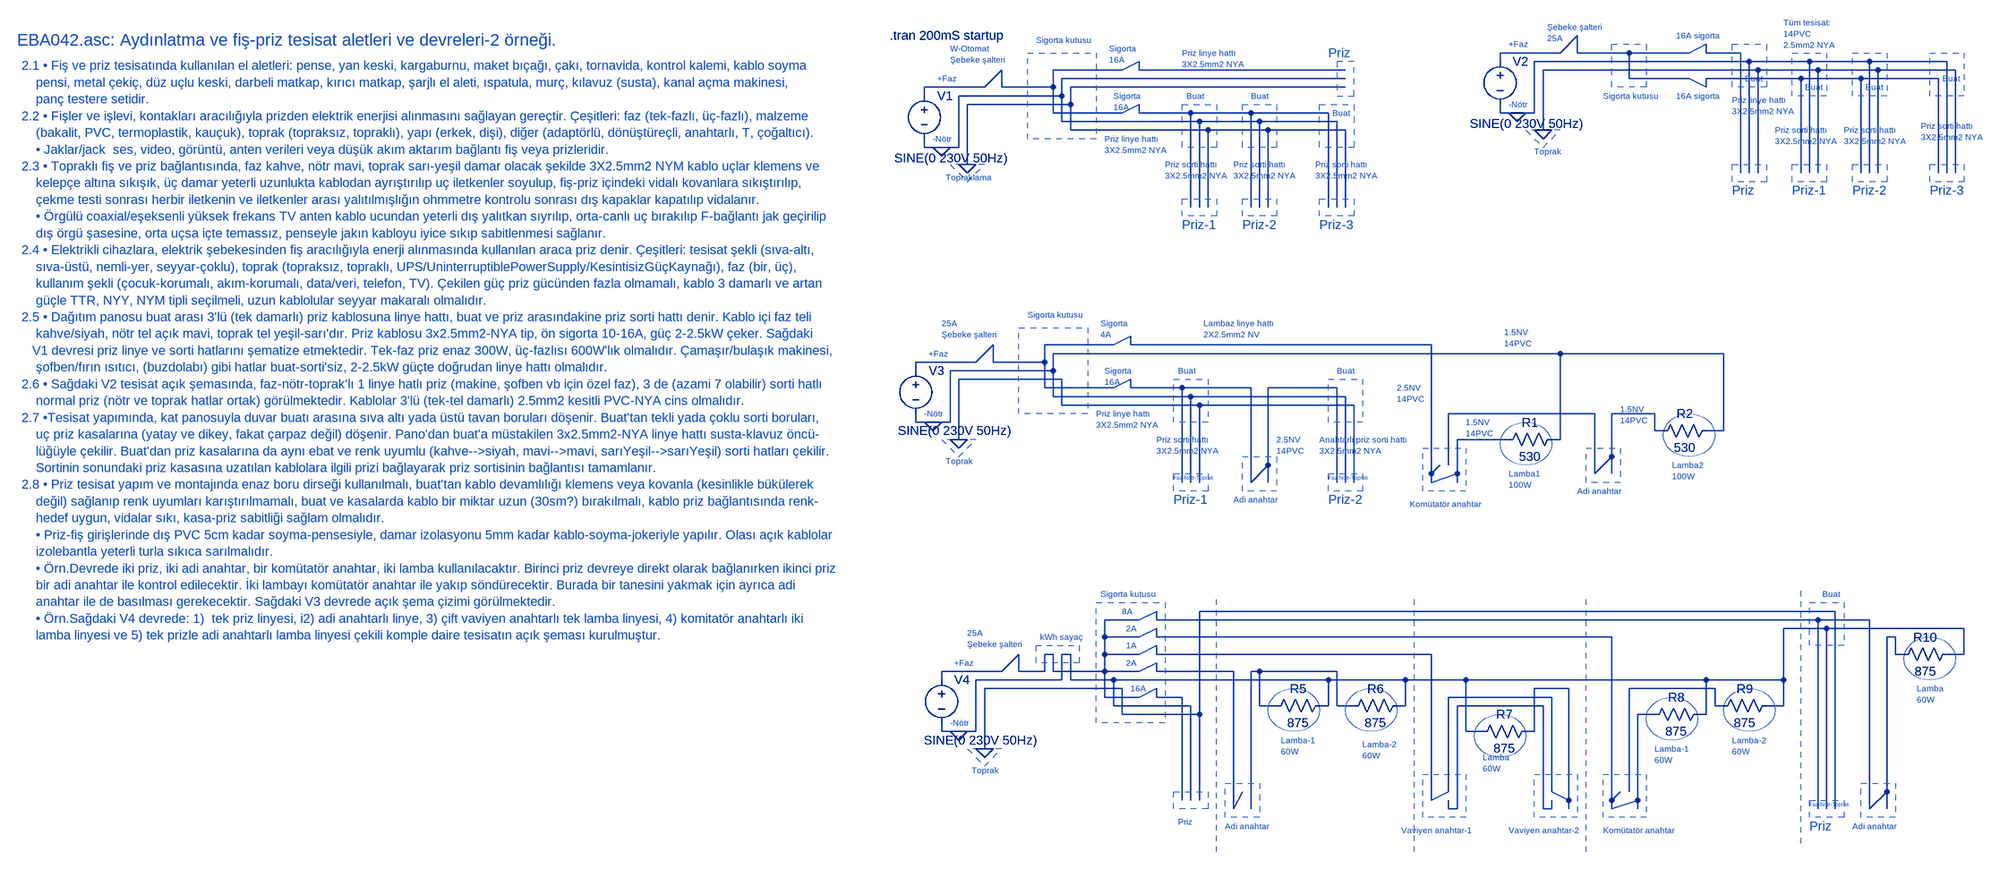
[diagram p0: schematic EBA042.asc]
EBA042.asc, the LTspice schematic file:
Version 4
SHEET 1 4076 2612
WIRE 3008 64 3040 32
WIRE 3008 64 2896 64
WIRE 3040 64 3040 32
WIRE 3136 64 3040 64
WIRE 3248 64 3280 48
WIRE 3248 64 3136 64
WIRE 3280 64 3280 48
WIRE 3344 64 3280 64
WIRE 2896 80 2896 64
WIRE 3360 80 2960 80
WIRE 3472 80 3360 80
WIRE 3584 80 3472 80
WIRE 3728 80 3584 80
WIRE 2192 96 2224 80
WIRE 2192 96 2064 96
WIRE 2224 96 2224 80
WIRE 2608 96 2224 96
WIRE 3376 96 2976 96
WIRE 3488 96 3376 96
WIRE 3600 96 3488 96
WIRE 3744 96 3600 96
WIRE 2608 112 2080 112
WIRE 3136 112 3136 64
WIRE 3248 112 3136 112
WIRE 3456 112 3280 112
WIRE 3568 112 3456 112
WIRE 3712 112 3568 112
WIRE 1936 128 1968 96
WIRE 1936 128 1824 128
WIRE 1968 128 1968 96
WIRE 2064 128 2064 96
WIRE 2064 128 1968 128
WIRE 2608 128 2096 128
WIRE 3280 128 3248 112
WIRE 3280 128 3280 112
WIRE 1824 144 1824 128
WIRE 2080 144 2080 112
WIRE 2080 144 1888 144
WIRE 2096 160 2096 128
WIRE 2096 160 1904 160
WIRE 2064 176 2064 128
WIRE 2192 176 2224 160
WIRE 2192 176 2064 176
WIRE 2224 176 2224 160
WIRE 2320 176 2224 176
WIRE 2432 176 2320 176
WIRE 2576 176 2432 176
WIRE 2896 176 2896 160
WIRE 2928 176 2896 176
WIRE 2960 176 2960 80
WIRE 2960 176 2928 176
WIRE 2080 192 2080 144
WIRE 2336 192 2080 192
WIRE 2448 192 2336 192
WIRE 2592 192 2448 192
WIRE 2096 208 2096 160
WIRE 2352 208 2096 208
WIRE 2464 208 2352 208
WIRE 2608 208 2464 208
WIRE 2976 208 2976 96
WIRE 1824 240 1824 224
WIRE 1856 240 1824 240
WIRE 1888 240 1888 144
WIRE 1888 240 1856 240
WIRE 1904 272 1904 160
WIRE 3344 288 3344 64
WIRE 3360 288 3360 80
WIRE 3376 288 3376 96
WIRE 3456 288 3456 112
WIRE 3472 288 3472 80
WIRE 3488 288 3488 96
WIRE 3568 288 3568 112
WIRE 3584 288 3584 80
WIRE 3600 288 3600 96
WIRE 3712 288 3712 112
WIRE 3728 288 3728 80
WIRE 3744 288 3744 96
WIRE 2320 352 2320 176
WIRE 2336 352 2336 192
WIRE 2352 352 2352 208
WIRE 2432 352 2432 176
WIRE 2448 352 2448 192
WIRE 2464 352 2464 208
WIRE 2576 352 2576 176
WIRE 2592 352 2592 192
WIRE 2608 352 2608 208
WIRE 2176 608 2208 592
WIRE 2176 608 2048 608
WIRE 2208 608 2208 592
WIRE 2768 608 2208 608
WIRE 3008 624 2064 624
WIRE 3312 624 3008 624
WIRE 1920 640 1952 608
WIRE 1920 640 1808 640
WIRE 1952 640 1952 608
WIRE 2048 640 2048 608
WIRE 2048 640 1952 640
WIRE 1808 656 1808 640
WIRE 2064 656 2064 624
WIRE 2064 656 1872 656
WIRE 2080 672 1888 672
WIRE 2048 688 2048 640
WIRE 2176 688 2208 672
WIRE 2176 688 2048 688
WIRE 2208 688 2208 672
WIRE 2304 688 2208 688
WIRE 2432 688 2304 688
WIRE 2592 688 2464 688
WIRE 2064 704 2064 656
WIRE 2320 704 2064 704
WIRE 2608 704 2320 704
WIRE 2080 720 2080 672
WIRE 2336 720 2080 720
WIRE 2624 720 2336 720
WIRE 3072 736 2800 736
WIRE 3184 736 3104 736
WIRE 1808 752 1808 736
WIRE 1840 752 1808 752
WIRE 1872 752 1872 656
WIRE 1872 752 1840 752
WIRE 3184 768 3184 736
WIRE 3200 768 3184 768
WIRE 3312 768 3312 624
WIRE 3312 768 3280 768
WIRE 1888 784 1888 672
WIRE 2912 784 2816 784
WIRE 3008 784 3008 624
WIRE 3008 784 2992 784
WIRE 3104 816 3104 736
WIRE 2464 832 2464 688
WIRE 2800 832 2800 736
WIRE 2768 848 2768 608
WIRE 2768 848 2784 832
WIRE 2816 848 2816 784
WIRE 3072 848 3072 736
WIRE 3072 848 3104 816
WIRE 3104 848 3104 816
WIRE 2304 864 2304 688
WIRE 2320 864 2320 704
WIRE 2336 864 2336 720
WIRE 2432 864 2432 688
WIRE 2432 864 2464 832
WIRE 2464 864 2464 832
WIRE 2592 864 2592 688
WIRE 2608 864 2608 704
WIRE 2624 864 2624 720
WIRE 2768 864 2768 848
WIRE 2768 864 2816 848
WIRE 2816 864 2816 848
WIRE 3520 1104 2336 1104
WIRE 2224 1120 2256 1104
WIRE 2224 1120 2160 1120
WIRE 2256 1120 2256 1104
WIRE 3488 1120 2256 1120
WIRE 3584 1120 3488 1120
WIRE 3504 1136 3424 1136
WIRE 3760 1136 3504 1136
WIRE 2160 1152 2160 1120
WIRE 2224 1152 2256 1136
WIRE 2224 1152 2160 1152
WIRE 2256 1152 2256 1136
WIRE 3104 1152 2256 1152
WIRE 3632 1152 3616 1152
WIRE 2064 1184 2048 1184
WIRE 2096 1184 2080 1184
WIRE 2160 1184 2160 1152
WIRE 2224 1184 2256 1168
WIRE 2224 1184 2160 1184
WIRE 2256 1184 2256 1168
WIRE 2768 1184 2256 1184
WIRE 3632 1184 3632 1152
WIRE 3648 1184 3632 1184
WIRE 3760 1184 3760 1136
WIRE 3760 1184 3728 1184
WIRE 1968 1216 2000 1184
WIRE 1968 1216 1856 1216
WIRE 2000 1216 2000 1184
WIRE 2048 1216 2048 1184
WIRE 2048 1216 2000 1216
WIRE 2064 1216 2064 1184
WIRE 2160 1216 2160 1184
WIRE 2160 1216 2064 1216
WIRE 2224 1216 2256 1200
WIRE 2224 1216 2160 1216
WIRE 2256 1216 2256 1200
WIRE 2400 1216 2256 1216
WIRE 2448 1216 2432 1216
WIRE 2592 1216 2448 1216
WIRE 1856 1232 1856 1216
WIRE 2080 1232 2080 1184
WIRE 2080 1232 1920 1232
WIRE 2096 1232 2096 1184
WIRE 2176 1232 2096 1232
WIRE 2576 1232 2176 1232
WIRE 2720 1232 2576 1232
WIRE 2832 1232 2720 1232
WIRE 3280 1232 2832 1232
WIRE 3424 1232 3424 1136
WIRE 3424 1232 3280 1232
WIRE 2192 1248 1936 1248
WIRE 3024 1248 2960 1248
WIRE 3296 1248 3136 1248
WIRE 2160 1264 2160 1216
WIRE 2224 1264 2256 1248
WIRE 2224 1264 2160 1264
WIRE 2256 1264 2256 1248
WIRE 2304 1264 2256 1264
WIRE 2992 1264 2800 1264
WIRE 2176 1280 2176 1232
WIRE 2320 1280 2176 1280
WIRE 2448 1280 2448 1216
WIRE 2480 1280 2448 1280
WIRE 2576 1280 2576 1232
WIRE 2576 1280 2560 1280
WIRE 2592 1280 2592 1216
WIRE 2624 1280 2592 1280
WIRE 2720 1280 2720 1232
WIRE 2720 1280 2704 1280
WIRE 2976 1280 2816 1280
WIRE 3296 1280 3296 1248
WIRE 3312 1280 3296 1280
WIRE 3424 1280 3424 1232
WIRE 3424 1280 3392 1280
WIRE 2192 1296 2192 1248
WIRE 2336 1296 2336 1104
WIRE 2336 1296 2192 1296
WIRE 3184 1296 3152 1296
WIRE 3280 1296 3280 1232
WIRE 3280 1296 3264 1296
WIRE 1856 1328 1856 1312
WIRE 1888 1328 1856 1328
WIRE 1920 1328 1920 1232
WIRE 1920 1328 1888 1328
WIRE 2832 1328 2832 1232
WIRE 2864 1328 2832 1328
WIRE 2960 1328 2960 1248
WIRE 2960 1328 2944 1328
WIRE 1936 1360 1936 1248
WIRE 2800 1440 2800 1264
WIRE 2992 1440 2992 1264
WIRE 3136 1440 3136 1248
WIRE 3616 1440 3616 1152
WIRE 2304 1456 2304 1264
WIRE 2320 1456 2320 1280
WIRE 2336 1456 2336 1296
WIRE 2768 1456 2768 1184
WIRE 2768 1456 2800 1440
WIRE 3024 1456 3024 1248
WIRE 3024 1456 2992 1440
WIRE 3104 1456 3104 1152
WIRE 3104 1456 3120 1440
WIRE 3152 1456 3152 1296
WIRE 2400 1472 2400 1216
WIRE 2400 1472 2416 1440
WIRE 2432 1472 2432 1216
WIRE 2800 1472 2800 1456
WIRE 2816 1472 2816 1280
WIRE 2816 1472 2800 1472
WIRE 2976 1472 2976 1280
WIRE 2992 1472 2992 1456
WIRE 2992 1472 2976 1472
WIRE 3024 1472 3024 1456
WIRE 3104 1472 3104 1456
WIRE 3104 1472 3152 1456
WIRE 3152 1472 3152 1456
WIRE 3488 1472 3488 1120
WIRE 3504 1472 3504 1136
WIRE 3520 1472 3520 1104
WIRE 3584 1472 3584 1120
WIRE 3584 1472 3616 1440
WIRE 3616 1472 3616 1440
FLAG 1856 240 0
FLAG 1904 272 0
FLAG 2928 176 0
FLAG 2976 208 0
FLAG 1840 752 0
FLAG 1888 784 0
FLAG 1888 1328 0
FLAG 1936 1360 0
SYMBOL voltage 1824 128 R0
WINDOW 3 -56 132 Left 2
WINDOW 123 0 0 Left 0
WINDOW 39 0 0 Left 0
SYMATTR Value SINE(0 230V 50Hz)
SYMATTR InstName V1
SYMBOL voltage 2896 64 R0
WINDOW 3 -56 132 Left 2
WINDOW 123 0 0 Left 0
WINDOW 39 0 0 Left 0
SYMATTR Value SINE(0 230V 50Hz)
SYMATTR InstName V2
SYMBOL voltage 1808 640 R0
WINDOW 3 -33 128 Left 2
WINDOW 123 0 0 Left 0
WINDOW 39 0 0 Left 0
SYMATTR Value SINE(0 230V 50Hz)
SYMATTR InstName V3
SYMBOL res 3008 768 R90
WINDOW 0 0 56 VBottom 2
WINDOW 3 32 56 VTop 2
SYMATTR InstName R1
SYMATTR Value 530
SYMBOL res 3296 752 R90
WINDOW 0 0 56 VBottom 2
WINDOW 3 32 56 VTop 2
SYMATTR InstName R2
SYMATTR Value 530
SYMBOL voltage 1856 1216 R0
WINDOW 3 -33 128 Left 2
WINDOW 123 0 0 Left 0
WINDOW 39 0 0 Left 0
SYMATTR Value SINE(0 230V 50Hz)
SYMATTR InstName V4
SYMBOL res 2576 1264 R90
WINDOW 0 0 56 VBottom 2
WINDOW 3 32 56 VTop 2
SYMATTR InstName R5
SYMATTR Value 875
SYMBOL res 2720 1264 R90
WINDOW 0 0 56 VBottom 2
WINDOW 3 32 56 VTop 2
SYMATTR InstName R6
SYMATTR Value 875
SYMBOL res 2960 1312 R90
WINDOW 0 0 56 VBottom 2
WINDOW 3 32 56 VTop 2
SYMATTR InstName R7
SYMATTR Value 875
SYMBOL res 3280 1280 R90
WINDOW 0 0 56 VBottom 2
WINDOW 3 32 56 VTop 2
SYMATTR InstName R8
SYMATTR Value 875
SYMBOL res 3408 1264 R90
WINDOW 0 0 56 VBottom 2
WINDOW 3 32 56 VTop 2
SYMATTR InstName R9
SYMATTR Value 875
SYMBOL res 3744 1168 R90
WINDOW 0 0 56 VBottom 2
WINDOW 3 32 56 VTop 2
SYMATTR InstName R10
SYMATTR Value 875
TEXT -152 40 Left 3 ;EBA042.asc: Aydınlatma ve fiş-priz tesisat aletleri ve devreleri-2 örneği.
TEXT -144 88 Left 2 ;2.1 • Fiş ve priz tesisatında kullanılan el aletleri: pense, yan keski, kargaburnu, maket bıçağı, çakı, tornavida, kontrol kalemi, kablo soyma\n    pensi, metal çekiç, düz uçlu keski, darbeli matkap, kırıcı matkap, şarjlı el aleti, ıspatula, murç, kılavuz (susta), kanal açma makinesi, \n    panç testere setidir.\n2.2 • Fişler ve işlevi, kontakları aracılığıyla prizden elektrik enerjisi alınmasını sağlayan gereçtir. Çeşitleri: faz (tek-fazlı, üç-fazlı), malzeme\n    (bakalit, PVC, termoplastik, kauçuk), toprak (topraksız, topraklı), yapı (erkek, dişi), diğer (adaptörlü, dönüştüreçli, anahtarlı, T, çoğaltıcı).\n    • Jaklar/jack  ses, video, görüntü, anten verileri veya düşük akım aktarım bağlantı fiş veya prizleridir.\n2.3 • Topraklı fiş ve priz bağlantısında, faz kahve, nötr mavi, toprak sarı-yeşil damar olacak şekilde 3X2.5mm2 NYM kablo uçlar klemens ve\n    kelepçe altına sıkışık, üç damar yeterli uzunlukta kablodan ayrıştırılıp uç iletkenler soyulup, fiş-priz içindeki vidalı kovanlara sıkıştırılıp, \n    çekme testi sonrası herbir iletkenin ve iletkenler arası yalıtılmışlığın ohmmetre kontrolu sonrası dış kapaklar kapatılıp vidalanır.\n    • Örgülü coaxial/eşeksenli yüksek frekans TV anten kablo ucundan yeterli dış yalıtkan sıyrılıp, orta-canlı uç bırakılıp F-bağlantı jak geçirilip\n    dış örgü şasesine, orta uçsa içte temassız, penseyle jakın kabloyu iyice sıkıp sabitlenmesi sağlanır.\n2.4 • Elektrikli cihazlara, elektrik şebekesinden fiş aracılığıyla enerji alınmasında kullanılan araca priz denir. Çeşitleri: tesisat şekli (sıva-altı,\n    sıva-üstü, nemli-yer, seyyar-çoklu), toprak (topraksız, topraklı, UPS/UninterruptiblePowerSupply/KesintisizGüçKaynağı), faz (bir, üç),\n    kullanım şekli (çocuk-korumalı, akım-korumalı, data/veri, telefon, TV). Çekilen güç priz gücünden fazla olmamalı, kablo 3 damarlı ve artan\n    güçle TTR, NYY, NYM tipli seçilmeli, uzun kablolular seyyar makaralı olmalıdır.\n2.5 • Dağıtım panosu buat arası 3'lü (tek damarlı) priz kablosuna linye hattı, buat ve priz arasındakine priz sorti hattı denir. Kablo içi faz teli\n    kahve/siyah, nötr tel açık mavi, toprak tel yeşil-sarı'dır. Priz kablosu 3x2.5mm2-NYA tip, ön sigorta 10-16A, güç 2-2.5kW çeker. Sağdaki\n   V1 devresi priz linye ve sorti hatlarını şematize etmektedir. Tek-faz priz enaz 300W, üç-fazlısı 600W'lık olmalıdır. Çamaşır/bulaşık makinesi,\n    şofben/fırın ısıtıcı, (buzdolabı) gibi hatlar buat-sorti'siz, 2-2.5kW güçte doğrudan linye hattı olmalıdır.\n2.6 • Sağdaki V2 tesisat açık şemasında, faz-nötr-toprak'lı 1 linye hatlı priz (makine, şofben vb için özel faz), 3 de (azami 7 olabilir) sorti hatlı\n    normal priz (nötr ve toprak hatlar ortak) görülmektedir. Kablolar 3'lü (tek-tel damarlı) 2.5mm2 kesitli PVC-NYA cins olmalıdır.\n2.7 •Tesisat yapımında, kat panosuyla duvar buatı arasına sıva altı yada üstü tavan boruları döşenir. Buat'tan tekli yada çoklu sorti boruları, \n    uç priz kasalarına (yatay ve dikey, fakat çarpaz değil) döşenir. Pano'dan buat'a müstakilen 3x2.5mm2-NYA linye hattı susta-klavuz öncü-\n    lüğüyle çekilir. Buat'dan priz kasalarına da aynı ebat ve renk uyumlu (kahve-->siyah, mavi-->mavi, sarıYeşil-->sarıYeşil) sorti hatları çekilir. \n    Sortinin sonundaki priz kasasına uzatılan kablolara ilgili prizi bağlayarak priz sortisinin bağlantısı tamamlanır.\n2.8 • Priz tesisat yapım ve montajında enaz boru dirseği kullanılmalı, buat'tan kablo devamlılığı klemens veya kovanla (kesinlikle bükülerek\n    değil) sağlanıp renk uyumları karıştırılmamalı, buat ve kasalarda kablo bir miktar uzun (30sm?) bırakılmalı, kablo priz bağlantısında renk-\n    hedef uygun, vidalar sıkı, kasa-priz sabitliği sağlam olmalıdır.\n    • Priz-fiş girişlerinde dış PVC 5cm kadar soyma-pensesiyle, damar izolasyonu 5mm kadar kablo-soyma-jokeriyle yapılır. Olası açık kablolar\n    izolebantla yeterli turla sıkıca sarılmalıdır.\n    • Örn.Devrede iki priz, iki adi anahtar, bir komütatör anahtar, iki lamba kullanılacaktır. Birinci priz devreye direkt olarak bağlanırken ikinci priz\n    bir adi anahtar ile kontrol edilecektir. İki lambayı komütatör anahtar ile yakıp söndürecektir. Burada bir tanesini yakmak için ayrıca adi \n    anahtar ile de basılması gerekecektir. Sağdaki V3 devrede açık şema çizimi görülmektedir.\n    • Örn.Sağdaki V4 devrede: 1)  tek priz linyesi, i2) adi anahtarlı linye, 3) çift vaviyen anahtarlı tek lamba linyesi, 4) komitatör anahtarlı iki \n    lamba linyesi ve 5) tek prizle adi anahtarlı lamba linyesi çekili komple daire tesisatın açık şeması kurulmuştur.
TEXT 1760 32 Left 2 !.tran 200mS startup
TEXT 1872 56 Left 1 ;W-Otomat\nŞebeke şalteri
TEXT 2032 40 Left 1 ;Sigorta kutusu
TEXT 2312 144 Left 1 ;Buat
TEXT 2432 144 Left 1 ;Buat
TEXT 2584 176 Left 1 ;Buat
TEXT 2176 144 Left 1 ;Sigorta\n16A
TEXT 2168 56 Left 1 ;Sigorta\n16A
TEXT 2304 64 Left 1 ;Priz linye hattı\n3X2.5mm2 NYA
TEXT 2160 224 Left 1 ;Priz linye hattı\n3X2.5mm2 NYA
TEXT 2272 272 Left 1 ;Priz sorti hattı\n3X2.5mm2 NYA
TEXT 2400 272 Left 1 ;Priz sorti hattı\n3X2.5mm2 NYA
TEXT 2552 272 Left 1 ;Priz sorti hattı\n3X2.5mm2 NYA
TEXT 1864 296 Left 1 ;Topraklama
TEXT 1840 224 Left 1 ;-Nötr
TEXT 1848 112 Left 1 ;+Faz
TEXT 2304 384 Left 2 ;Priz-1
TEXT 2416 384 Left 2 ;Priz-2
TEXT 2560 384 Left 2 ;Priz-3
TEXT 2576 64 Left 2 ;Priz
TEXT 2984 16 Left 1 ;Şebeke şalteri\n25A
TEXT 3088 144 Left 1 ;Sigorta kutusu
TEXT 2960 248 Left 1 ;Toprak
TEXT 2912 160 Left 1 ;-Nötr
TEXT 2912 48 Left 1 ;+Faz
TEXT 3720 112 Left 1 ;Buat
TEXT 3408 208 Left 1 ;Priz sorti hattı\n3X2.5mm2 NYA
TEXT 3536 208 Left 1 ;Priz sorti hattı\n3X2.5mm2 NYA
TEXT 3440 320 Left 2 ;Priz-1
TEXT 3552 320 Left 2 ;Priz-2
TEXT 3696 320 Left 2 ;Priz-3
TEXT 3352 112 Left 1 ;Buat
TEXT 3328 320 Left 2 ;Priz
TEXT 3224 32 Left 1 ;16A sigorta
TEXT 3224 144 Left 1 ;16A sigorta
TEXT 3424 8 Left 1 ;Tüm tesisat:\n14PVC\n2.5mm2 NYA
TEXT 3680 200 Left 1 ;Priz sorti hattı\n3X2.5mm2 NYA
TEXT 3328 152 Left 1 ;Priz linye hattı\n3X2.5mm2 NYA
TEXT 3576 128 Left 1 ;Buat
TEXT 3464 128 Left 1 ;Buat
TEXT 1856 568 Left 1 ;25A\nŞebeke şalteri
TEXT 2016 552 Left 1 ;Sigorta kutusu
TEXT 2296 656 Left 1 ;Buat
TEXT 2592 656 Left 1 ;Buat
TEXT 2160 656 Left 1 ;Sigorta\n16A
TEXT 2152 568 Left 1 ;Sigorta\n4A
TEXT 2144 736 Left 1 ;Priz linye hattı\n3X2.5mm2 NYA
TEXT 2256 784 Left 1 ;Priz sorti hattı\n3X2.5mm2 NYA
TEXT 2560 784 Left 1 ;Anahtarlı priz sorti hattı\n3X2.5mm2 NYA
TEXT 1864 824 Left 1 ;Toprak
TEXT 1824 736 Left 1 ;-Nötr
TEXT 1832 624 Left 1 ;+Faz
TEXT 2288 896 Left 2 ;Priz-1
TEXT 2576 896 Left 2 ;Priz-2
TEXT 2400 896 Left 1 ;Adi anahtar
TEXT 2480 784 Left 1 ;2.5NV\n14PVC
TEXT 2288 856 Left 0 ;Faz-Nötr-Toprak
TEXT 2576 856 Left 0 ;Faz-Nötr-Toprak
TEXT 2728 904 Left 1 ;Komütatör anahtar
TEXT 2912 848 Left 1 ;Lamba1\n100W
TEXT 2704 688 Left 1 ;2.5NV\n14PVC
TEXT 2832 752 Left 1 ;1.5NV\n14PVC
TEXT 3216 832 Left 1 ;Lamba2\n100W
TEXT 2904 584 Left 1 ;1.5NV\n14PVC
TEXT 3120 728 Left 1 ;1.5NV\n14PVC
TEXT 3040 880 Left 1 ;Adi anahtar
TEXT 2344 568 Left 1 ;Lambaz linye hattı\n2X2.5mm2 NV
TEXT 1904 1144 Left 1 ;25A\nŞebeke şalteri
TEXT 2152 1072 Left 1 ;Sigorta kutusu
TEXT 1912 1400 Left 1 ;Toprak
TEXT 1872 1312 Left 1 ;-Nötr
TEXT 1880 1200 Left 1 ;+Faz
TEXT 2040 1152 Left 1 ;kWh sayaç
TEXT 2296 1496 Left 1 ;Priz
TEXT 2384 1504 Left 1 ;Adi anahtar
TEXT 2488 1344 Left 1 ;Lamba-1\n60W
TEXT 2640 1352 Left 1 ;Lamba-2\n60W
TEXT 2712 1512 Left 1 ;Vaviyen anahtar-1
TEXT 2864 1376 Left 1 ;Lamba\n60W
TEXT 2912 1512 Left 1 ;Vaviyen anahtar-2
TEXT 3088 1512 Left 1 ;Komütatör anahtar
TEXT 3184 1360 Left 1 ;Lamba-1\n60W
TEXT 3328 1344 Left 1 ;Lamba-2\n60W
TEXT 3472 1504 Left 2 ;Priz
TEXT 3552 1504 Left 1 ;Adi anahtar
TEXT 3472 1464 Left 0 ;Faz-Nötr-Toprak
TEXT 3672 1248 Left 1 ;Lamba\n60W
TEXT 3496 1072 Left 1 ;Buat
TEXT 2208 1248 Left 1 ;16A
TEXT 2200 1200 Left 1 ;2A
TEXT 2200 1168 Left 1 ;1A
TEXT 2200 1136 Left 1 ;2A
TEXT 2192 1104 Left 1 ;8A
LINE Normal 1936 272 1872 272 2
LINE Normal 1904 304 1936 272 2
LINE Normal 1872 272 1904 304 2
LINE Normal 3008 208 2944 208 2
LINE Normal 2976 240 3008 208 2
LINE Normal 2944 208 2976 240 2
LINE Normal 1920 784 1856 784 2
LINE Normal 1888 816 1920 784 2
LINE Normal 1856 784 1888 816 2
LINE Normal 1968 1360 1904 1360 2
LINE Normal 1936 1392 1968 1360 2
LINE Normal 1904 1360 1936 1392 2
LINE Normal 3456 1536 3456 1056 2
LINE Normal 3056 1552 3056 1072 2
LINE Normal 2736 1552 2736 1072 2
LINE Normal 2368 1552 2368 1072 2
RECTANGLE Normal 2144 224 2016 64 2
RECTANGLE Normal 2368 240 2304 160 2
RECTANGLE Normal 2480 240 2416 160 2
RECTANGLE Normal 2624 240 2560 160 2
RECTANGLE Normal 2368 368 2304 336 2
RECTANGLE Normal 2480 368 2416 336 2
RECTANGLE Normal 2624 368 2560 336 2
RECTANGLE Normal 2592 144 2624 80 2
RECTANGLE Normal 3168 128 3104 48 2
RECTANGLE Normal 3504 304 3440 272 2
RECTANGLE Normal 3616 304 3552 272 2
RECTANGLE Normal 3760 304 3696 272 2
RECTANGLE Normal 3392 304 3328 272 2
RECTANGLE Normal 3392 128 3328 48 2
RECTANGLE Normal 3760 144 3696 64 2
RECTANGLE Normal 3616 144 3552 64 2
RECTANGLE Normal 3504 144 3440 64 2
RECTANGLE Normal 2128 736 2000 576 2
RECTANGLE Normal 2352 752 2288 672 2
RECTANGLE Normal 2640 752 2576 672 2
RECTANGLE Normal 2352 880 2288 848 2
RECTANGLE Normal 2640 880 2576 848 2
RECTANGLE Normal 2480 880 2416 816 2
RECTANGLE Normal 2832 880 2752 800 2
RECTANGLE Normal 3120 864 3056 800 2
RECTANGLE Normal 2272 1312 2144 1088 2
RECTANGLE Normal 2112 1200 2032 1168 2
RECTANGLE Normal 2352 1472 2288 1440 2
RECTANGLE Normal 2448 1488 2384 1424 2
RECTANGLE Normal 2832 1488 2752 1408 2
RECTANGLE Normal 3040 1488 2960 1408 2
RECTANGLE Normal 3168 1488 3088 1408 2
RECTANGLE Normal 3536 1168 3472 1088 2
RECTANGLE Normal 3536 1488 3472 1456 2
RECTANGLE Normal 3632 1488 3568 1424 2
CIRCLE Normal 2992 832 2896 752 2
CIRCLE Normal 3296 816 3200 736 2
CIRCLE Normal 2560 1328 2464 1248 2
CIRCLE Normal 2704 1328 2608 1248 2
CIRCLE Normal 2944 1376 2848 1296 2
CIRCLE Normal 3264 1344 3168 1264 2
CIRCLE Normal 3408 1328 3312 1248 2
CIRCLE Normal 3744 1232 3648 1152 2

The netlist it stands for:
* EBA042.asc
V1 N002 0 SINE(0 230V 50Hz)
V2 N001 0 SINE(0 230V 50Hz)
V3 N003 0 SINE(0 230V 50Hz)
R1 0 N003 530
R2 0 N004 530
V4 N005 0 SINE(0 230V 50Hz)
R5 0 N006 875
R6 0 N006 875
R7 N005 0 875
R8 0 N005 875
R9 0 N007 875
R10 0 N005 875
* EBA042.asc: Aydınlatma ve fiş-priz tesisat aletleri ve devreleri-2 örneği.
* 2.1 • Fiş ve priz tesisatında kullanılan el aletleri: pense, yan keski, kargaburnu, maket bıçağı, çakı, tornavida, kontrol kalemi, kablo soyma
*     pensi, metal çekiç, düz uçlu keski, darbeli matkap, kırıcı matkap, şarjlı el aleti, ıspatula, murç, kılavuz (susta), kanal açma makinesi,
*     panç testere setidir.
* 2.2 • Fişler ve işlevi, kontakları aracılığıyla prizden elektrik enerjisi alınmasını sağlayan gereçtir. Çeşitleri: faz (tek-fazlı, üç-fazlı), malzeme
*     (bakalit, PVC, termoplastik, kauçuk), toprak (topraksız, topraklı), yapı (erkek, dişi), diğer (adaptörlü, dönüştüreçli, anahtarlı, T, çoğaltıcı).
*     • Jaklar/jack  ses, video, görüntü, anten verileri veya düşük akım aktarım bağlantı fiş veya prizleridir.
* 2.3 • Topraklı fiş ve priz bağlantısında, faz kahve, nötr mavi, toprak sarı-yeşil damar olacak şekilde 3X2.5mm2 NYM kablo uçlar klemens ve
*     kelepçe altına sıkışık, üç damar yeterli uzunlukta kablodan ayrıştırılıp uç iletkenler soyulup, fiş-priz içindeki vidalı kovanlara sıkıştırılıp,
*     çekme testi sonrası herbir iletkenin ve iletkenler arası yalıtılmışlığın ohmmetre kontrolu sonrası dış kapaklar kapatılıp vidalanır.
*     • Örgülü coaxial/eşeksenli yüksek frekans TV anten kablo ucundan yeterli dış yalıtkan sıyrılıp, orta-canlı uç bırakılıp F-bağlantı jak geçirilip
*     dış örgü şasesine, orta uçsa içte temassız, penseyle jakın kabloyu iyice sıkıp sabitlenmesi sağlanır.
* 2.4 • Elektrikli cihazlara, elektrik şebekesinden fiş aracılığıyla enerji alınmasında kullanılan araca priz denir. Çeşitleri: tesisat şekli (sıva-altı,
*     sıva-üstü, nemli-yer, seyyar-çoklu), toprak (topraksız, topraklı, UPS/UninterruptiblePowerSupply/KesintisizGüçKaynağı), faz (bir, üç),
*     kullanım şekli (çocuk-korumalı, akım-korumalı, data/veri, telefon, TV). Çekilen güç priz gücünden fazla olmamalı, kablo 3 damarlı ve artan
*     güçle TTR, NYY, NYM tipli seçilmeli, uzun kablolular seyyar makaralı olmalıdır.
* 2.5 • Dağıtım panosu buat arası 3'lü (tek damarlı) priz kablosuna linye hattı, buat ve priz arasındakine priz sorti hattı denir. Kablo içi faz teli
*     kahve/siyah, nötr tel açık mavi, toprak tel yeşil-sarı'dır. Priz kablosu 3x2.5mm2-NYA tip, ön sigorta 10-16A, güç 2-2.5kW çeker. Sağdaki
*    V1 devresi priz linye ve sorti hatlarını şematize etmektedir. Tek-faz priz enaz 300W, üç-fazlısı 600W'lık olmalıdır. Çamaşır/bulaşık makinesi,
*     şofben/fırın ısıtıcı, (buzdolabı) gibi hatlar buat-sorti'siz, 2-2.5kW güçte doğrudan linye hattı olmalıdır.
* 2.6 • Sağdaki V2 tesisat açık şemasında, faz-nötr-toprak'lı 1 linye hatlı priz (makine, şofben vb için özel faz), 3 de (azami 7 olabilir) sorti hatlı
*     normal priz (nötr ve toprak hatlar ortak) görülmektedir. Kablolar 3'lü (tek-tel damarlı) 2.5mm2 kesitli PVC-NYA cins olmalıdır.
* 2.7 •Tesisat yapımında, kat panosuyla duvar buatı arasına sıva altı yada üstü tavan boruları döşenir. Buat'tan tekli yada çoklu sorti boruları,
*     uç priz kasalarına (yatay ve dikey, fakat çarpaz değil) döşenir. Pano'dan buat'a müstakilen 3x2.5mm2-NYA linye hattı susta-klavuz öncü-
*     lüğüyle çekilir. Buat'dan priz kasalarına da aynı ebat ve renk uyumlu (kahve-->siyah, mavi-->mavi, sarıYeşil-->sarıYeşil) sorti hatları çekilir.
*     Sortinin sonundaki priz kasasına uzatılan kablolara ilgili prizi bağlayarak priz sortisinin bağlantısı tamamlanır.
* 2.8 • Priz tesisat yapım ve montajında enaz boru dirseği kullanılmalı, buat'tan kablo devamlılığı klemens veya kovanla (kesinlikle bükülerek
*     değil) sağlanıp renk uyumları karıştırılmamalı, buat ve kasalarda kablo bir miktar uzun (30sm?) bırakılmalı, kablo priz bağlantısında renk-
*     hedef uygun, vidalar sıkı, kasa-priz sabitliği sağlam olmalıdır.
*     • Priz-fiş girişlerinde dış PVC 5cm kadar soyma-pensesiyle, damar izolasyonu 5mm kadar kablo-soyma-jokeriyle yapılır. Olası açık kablolar
*     izolebantla yeterli turla sıkıca sarılmalıdır.
*     • Örn.Devrede iki priz, iki adi anahtar, bir komütatör anahtar, iki lamba kullanılacaktır. Birinci priz devreye direkt olarak bağlanırken ikinci priz
*     bir adi anahtar ile kontrol edilecektir. İki lambayı komütatör anahtar ile yakıp söndürecektir. Burada bir tanesini yakmak için ayrıca adi
*     anahtar ile de basılması gerekecektir. Sağdaki V3 devrede açık şema çizimi görülmektedir.
*     • Örn.Sağdaki V4 devrede: 1)  tek priz linyesi, i2) adi anahtarlı linye, 3) çift vaviyen anahtarlı tek lamba linyesi, 4) komitatör anahtarlı iki
*     lamba linyesi ve 5) tek prizle adi anahtarlı lamba linyesi çekili komple daire tesisatın açık şeması kurulmuştur.
.tran 200mS startup
* W-Otomat
* Şebeke şalteri
* Sigorta kutusu
* Buat
* Buat
* Buat
* Sigorta
* 16A
* Sigorta
* 16A
* Priz linye hattı
* 3X2.5mm2 NYA
* Priz linye hattı
* 3X2.5mm2 NYA
* Priz sorti hattı
* 3X2.5mm2 NYA
* Priz sorti hattı
* 3X2.5mm2 NYA
* Priz sorti hattı
* 3X2.5mm2 NYA
* Topraklama
* -Nötr
* +Faz
* Priz-1
* Priz-2
* Priz-3
* Priz
* Şebeke şalteri
* 25A
* Sigorta kutusu
* Toprak
* -Nötr
* +Faz
* Buat
* Priz sorti hattı
* 3X2.5mm2 NYA
* Priz sorti hattı
* 3X2.5mm2 NYA
* Priz-1
* Priz-2
* Priz-3
* Buat
* Priz
* 16A sigorta
* 16A sigorta
* Tüm tesisat:
* 14PVC
* 2.5mm2 NYA
* Priz sorti hattı
* 3X2.5mm2 NYA
* Priz linye hattı
* 3X2.5mm2 NYA
* Buat
* Buat
* 25A
* Şebeke şalteri
* Sigorta kutusu
* Buat
* Buat
* Sigorta
* 16A
* Sigorta
* 4A
* Priz linye hattı
* 3X2.5mm2 NYA
* Priz sorti hattı
* 3X2.5mm2 NYA
* Anahtarlı priz sorti hattı
* 3X2.5mm2 NYA
* Toprak
* -Nötr
* +Faz
* Priz-1
* Priz-2
* Adi anahtar
* 2.5NV
* 14PVC
* Faz-Nötr-Toprak
* Faz-Nötr-Toprak
* Komütatör anahtar
* Lamba1
* 100W
* 2.5NV
* 14PVC
* 1.5NV
* 14PVC
* Lamba2
* 100W
* 1.5NV
* 14PVC
* 1.5NV
* 14PVC
* Adi anahtar
* Lambaz linye hattı
* 2X2.5mm2 NV
* 25A
* Şebeke şalteri
* Sigorta kutusu
* Toprak
* -Nötr
* +Faz
* kWh sayaç
* Priz
* Adi anahtar
* Lamba-1
* 60W
* Lamba-2
* 60W
* Vaviyen anahtar-1
* Lamba
* 60W
* Vaviyen anahtar-2
* Komütatör anahtar
* Lamba-1
* 60W
* Lamba-2
* 60W
* Priz
* Adi anahtar
* Faz-Nötr-Toprak
* Lamba
* 60W
* Buat
* 16A
* 2A
* 1A
* 2A
* 8A
.backanno
.end